# EAGLE design led_shirt (EAGLE 5.11)
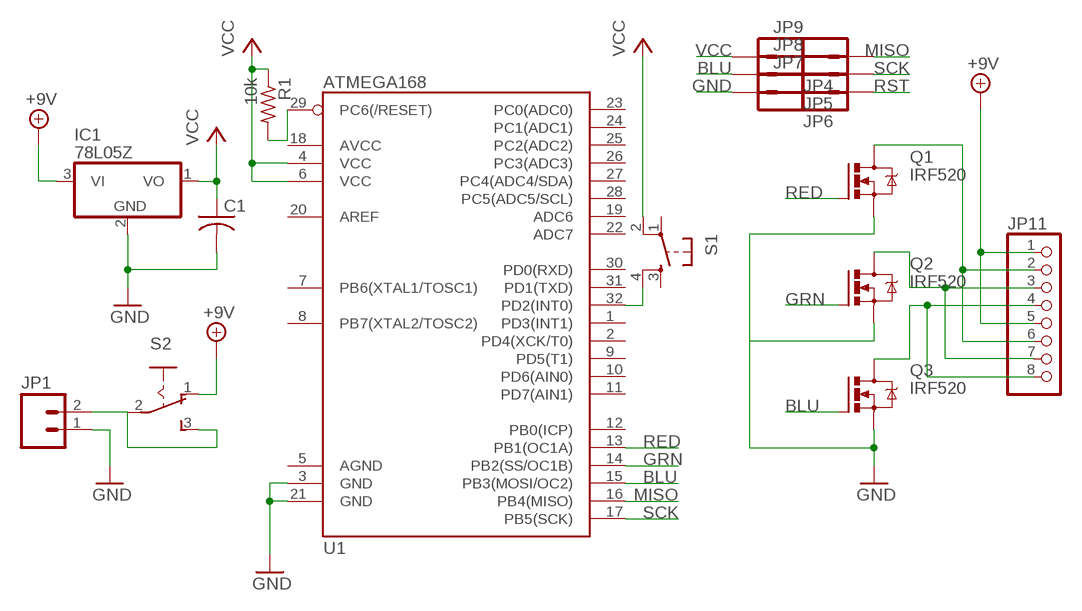
[diagram p0: schematic, sheet 1]

## Parts
C1  C-US025-025X050  [C025-025X050]
IC1  78L05Z  [TO92]
JP1  M02PTH3  [1X02_LONGPADS]
JP4  M01SMD-4.5X1.5  [PAD-1.5X4.5]
JP5  M01SMD-4.5X1.5  [PAD-1.5X4.5]
JP6  M01SMD-4.5X1.5  [PAD-1.5X4.5]
JP7  M01SMD-4.5X1.5  [PAD-1.5X4.5]
JP8  M01SMD-4.5X1.5  [PAD-1.5X4.5]
JP9  M01SMD-4.5X1.5  [PAD-1.5X4.5]
JP11  PINHD-1X8  [1X08]
Q1  IRF520  [TO220BV]
Q2  IRF520  [TO220BV]
Q3  IRF520  [TO220BV]
R1  10k  R-US_R0805  [R0805]
S1  TAC_SWITCHSMD  [TACTILE_SWITCH_SMD]
S2  255SB  [255SB]
U1  ATMEGA168  [TQFP32-08]

## Nets
+9V: IC1.3(VI) JP11.1 JP11.5 S2.1(O)
BLU: JP8.P$1 Q3.G U1.15(PB3(MOSI/OC2))
GND: C1.2 IC1.2(GND) JP1.1 JP7.P$1 Q1.S Q2.S Q3.S U1.3(GND) U1.21(GND)
GRN: Q2.G U1.14(PB2(SS/OC1B))
MISO: JP4.P$1 U1.16(PB4(MISO))
N$1: JP11.2 JP11.6 Q1.D
N$3: JP11.4 JP11.8 Q3.D
N$5: S1.4 U1.32(PD2(INT0))
N$7: JP11.3 JP11.7 Q2.D
N$8: JP1.2 S2.2(P) S2.3(S)
RED: Q1.G U1.13(PB1(OC1A))
RST: JP6.P$1 R1.2 U1.29(PC6(/RESET))
SCK: JP5.P$1 U1.17(PB5(SCK))
VCC: C1.1 IC1.1(VO) JP9.P$1 R1.1 S1.2 U1.4(VCC) U1.6(VCC)
Unconnected: S1.1 S1.3 U1.1(PD3(INT1)) U1.2(PD4(XCK/T0)) U1.5(AGND) U1.7(PB6(XTAL1/TOSC1)) U1.8(PB7(XTAL2/TOSC2)) U1.9(PD5(T1)) U1.10(PD6(AIN0)) U1.11(PD7(AIN1)) U1.12(PB0(ICP)) U1.18(AVCC) U1.19(ADC6) U1.20(AREF) U1.22(ADC7) U1.23(PC0(ADC0)) U1.24(PC1(ADC1)) U1.25(PC2(ADC2)) U1.26(PC3(ADC3)) U1.27(PC4(ADC4/SDA)) U1.28(PC5(ADC5/SCL)) U1.30(PD0(RXD)) U1.31(PD1(TXD))

## Library data of the parts
C1 = rcl:C-US: CAPACITOR, American symbol
IC1 = linear:78*: Positive VOLTAGE REGULATOR Source: http://cache.national.com/ds/LM/LM78L05.pdf http://www.fairchildsemi.com/ds/LM/LM7805.pdf
JP1 = sparkfun:M02: Header 2 Standard 2-pin 0.1" header. Use with straight break away headers (SKU : PRT-00116), right angle break away headers (PRT-00553), swiss pins (PRT-00743), machine pins (PRT-00117), and female headers (PRT-00115). Molex polarized connector foot print use with SKU : PRT-08233 with associated crimp pins and housings.
JP4-JP9 = sparkfun:M01: Header 1 Standard 1-pin 0.1" header. Use with straight break away headers (SKU : PRT-00116), right angle break away headers (PRT-00553), swiss pins (PRT-00743), machine pins (PRT-00117), and female headers (PRT-00115).
JP11 = pinhead:PINHD-1X8: PIN HEADER
Q1-Q3 = transistor-power:IRF520: HEXFET Power MOSFET
R1 = resistor:R-US_: RESISTOR, American symbol
S1 = sparkfun:TAC_SWITCH: Momentary Switch Button commonly used for reset or general input. Spark Fun Electronics SKU : COM-00097
S2 = switch:255SB: SLIDING SWITCH Distributor Buerklin, 11G810
U1 = sparkfun:ATMEGA168

## Board
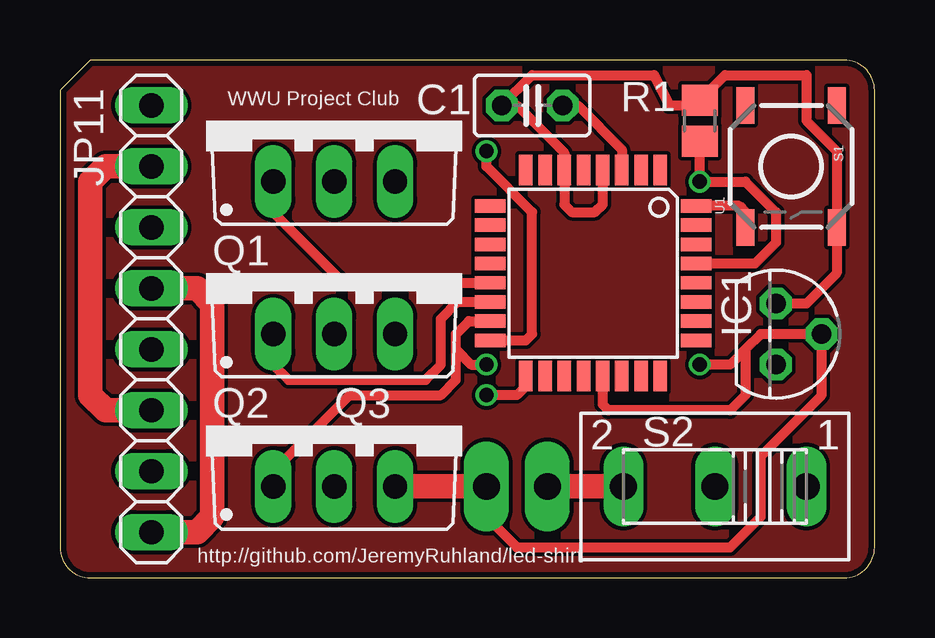
[diagram p1: board, top side]
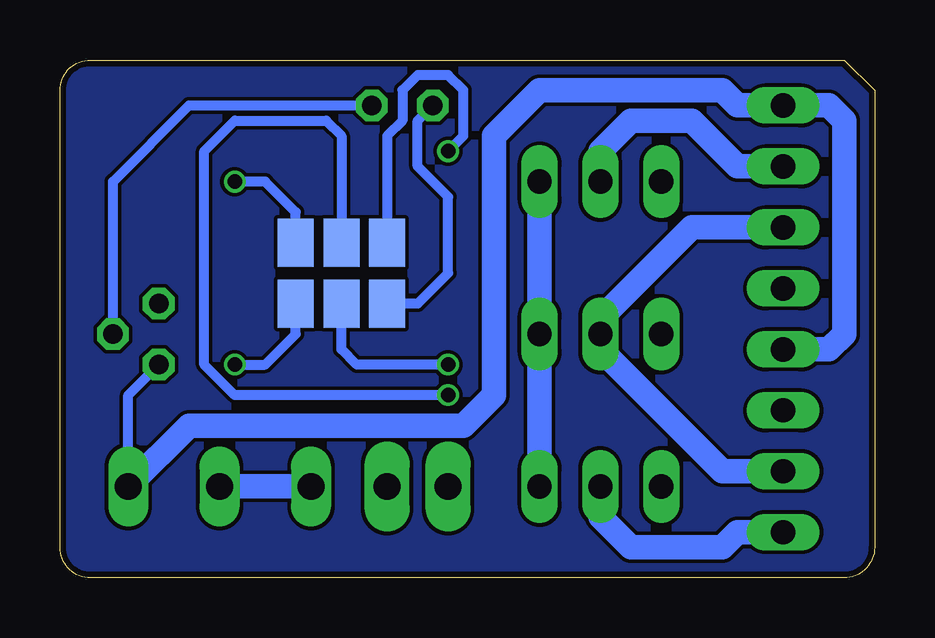
[diagram p2: board, bottom side, seen from below]

Size 33.96 x 21.58 mm. Coordinates in mm from the lower left corner, seen from the top.
Outline: 32.69,0 arc90 33.96,1.27 33.96,20.31 arc90 32.69,21.58 1.27,21.58 0,20.31 0,1.27 arc90 1.27,0 32.69,0
Copper layers (1*16): Top 0.035mm / dielectric 1.5mm / Bottom 0.035mm
Design rules "ITead_rule": minimum track width 6mil, minimum drill 12mil, track to track 6mil, track to pad 6mil, pad to pad 6mil, via to via 6mil, smd to smd 0mil, copper to edge 10mil, drill to drill 10mil, minimum pad ring 10mil, minimum via ring 6mil, stop-mask expansion 2mil, vias tented up to drill 100mil, thermal gap 10mil

### Footprints (pad centres in the part's own frame; a part is rotated, then mirrored left to right if it is on the bottom)
C025-025X050 = drill 0.813 octagon: 1 -1.27,0; 2 1.27,0
TO92 = drill 0.813 octagon: 1 -1.27,0; 2 0,1.905; 3 1.27,0
1X02_LONGPADS = drill 1.118 pad 1.88 long: 1 0,0; 2 2.54,0
PAD-1.5X4.5 = smd 1.5 x 2: P$1 0,0
1X08 = drill 1.016 long: 1 -8.89,0; 2 -6.35,0; 3 -3.81,0; 4 -1.27,0; 5 1.27,0; 6 3.81,0; 7 6.35,0; 8 8.89,0
TO220BV = drill 1.016 long: D 0,-2.54; G -2.54,-2.54; S 2.54,-2.54
R0805 = smd 1.3 x 1.5: 1 -0.85,0; 2 0.85,0
TACTILE_SWITCH_SMD = smd 1.524 x 0.762: 1 -2.54,1.905; 2 2.54,1.905; 3 -2.54,-1.905; 4 2.54,-1.905
255SB = drill 1.118 long: 1 -3.81,0; 2 0,0; 3 3.81,0
TQFP32-08 = smd 1.27 x 0.559: 1 -4.293,2.8; 2 -4.293,2; 3 -4.293,1.2; 4 -4.293,0.4; 5 -4.293,-0.4; 6 -4.293,-1.2; 7 -4.293,-2; 8 -4.293,-2.8; 17 4.293,-2.8; 18 4.293,-2; 19 4.293,-1.2; 20 4.293,-0.4; 21 4.293,0.4; 22 4.293,1.2; 23 4.293,2; 24 4.293,2.8 | smd 0.559 x 1.27: 9 -2.8,-4.293; 10 -2,-4.293; 11 -1.2,-4.293; 12 -0.4,-4.293; 13 0.4,-4.293; 14 1.2,-4.293; 15 2,-4.293; 16 2.8,-4.293; 25 2.8,4.293; 26 2,4.293; 27 1.2,4.293; 28 0.4,4.293; 29 -0.4,4.293; 30 -1.2,4.293; 31 -2,4.293; 32 -2.8,4.293

### Placement (x,y rotation side)
C1  19.68,19.68 0 top
IC1  29.84,10.16 270 top
JP1  17.78,3.81 0 top
JP4  20.32,13.97 180 bottom
JP5  22.23,13.97 180 bottom
JP6  24.13,13.97 180 bottom
JP7  24.13,11.43 180 bottom
JP8  22.23,11.43 180 bottom
JP9  20.32,11.43 180 bottom
JP11  3.81,10.79 270 top
Q1  11.43,19.05 0 top
Q2  11.43,12.7 0 top
Q3  11.43,6.35 0 top
R1  26.67,19.05 270 top
S1  30.48,17.14 270 top
S2  27.3,3.81 180 top
U1  22.23,12.7 270 top

### Tracks (layer width: path | path; a pad name or v marks a point on that pad's centre or on a via)
+9V
  Bottom 0.406: S2.1 31.11,7.62 IC1.3
  Bottom 1.016: JP11.5 1.91,9.53 1.27,10.16 1.27,19.05 1.91,19.68 JP11.1 5.71,19.68 6.35,20.32 13.97,20.32 15.88,18.41 15.88,7.62 17.14,6.35 28.57,6.35 S2.1
BLU  (via drill 0.6)
  Top 0.406: U1.15 17.05,10.7 16.51,10.16 16.51,9.53 | 16.51,9.53 16.51,8.26 15.88,7.62 12.06,7.62 8.89,4.45 Q3.G | v17.78,8.89 17.14,8.89 16.51,9.53
  Bottom 0.406: JP8.P$1 22.23,9.53 21.59,8.89 v17.78,8.89
GND  (via drill 0.6)
  Top 0.406: U1.3 23.43,17.85 21.59,19.68 C1.2 | JP1.1 17.78,2.54 19.05,1.27 27.94,1.27 29.21,2.54 29.21,5.08 31.75,7.62 IC1.2 29.21,10.16 28.57,9.53 | U1.21 22.62,7.22 22.86,6.99 27.94,6.99 28.57,7.62 28.57,9.53 | v26.67,8.89 27.94,8.89 28.57,9.53
  Top 1.016: Q3.S JP1.1
  Bottom 0.406: C1.2 28.57,19.68 31.75,16.51 IC1.2 | v26.67,8.89 25.4,8.89 24.13,10.16 JP7.P$1
  Bottom 1.016: Q1.S Q2.S Q3.S
GRN
  Top 0.406: Q2.G 8.89,8.89 9.53,8.26 15.24,8.26 15.88,8.89 15.88,10.79 16.58,11.5 U1.14
MISO  (via drill 0.6)
  Top 0.406: v17.78,17.78 17.78,17.14 19.68,15.24 19.68,10.16 19.43,9.9 U1.16
  Bottom 0.406: v17.78,17.78 17.14,18.41 17.14,20.32 17.78,20.95 19.05,20.95 19.68,20.32 19.68,19.05 20.32,18.41 JP4.P$1
N$1
  Top 1.016: JP11.6 1.91,6.99 1.27,7.62 1.27,16.51 1.91,17.14 JP11.2
  Bottom 1.016: Q1.D 11.43,17.78 10.16,19.05 7.62,19.05 5.71,17.14 JP11.2
N$2
  pour Top: 33.02,0 arc90 34.29,1.27 34.29,20.32 arc90 33.02,21.59 1.27,21.59 0,20.32 0,1.27 arc90 1.27,0
N$3
  Top 1.016: JP11.4 5.71,12.06 6.35,11.43 6.35,2.54 5.71,1.91 JP11.8
  Bottom 1.016: Q3.D 11.43,2.54 10.16,1.27 6.35,1.27 5.71,1.91 JP11.8
N$4
  pour Bottom: 33.02,21.59 arc-90 34.29,20.32 34.29,1.27 arc-90 33.02,0 1.27,0 arc-90 0,1.27 0,20.32 1.27,21.59
N$5
  Top 0.406: U1.32 28.32,15.5 28.57,15.24 S1.4
N$7
  Bottom 1.016: JP11.7 6.35,4.45 11.43,9.53 Q2.D 11.43,10.79 7.62,14.61 JP11.3
N$8
  Top 1.016: JP1.2 S2.3
  Bottom 1.016: S2.3 S2.2
RED
  Top 0.406: Q1.G 8.89,15.24 11.83,12.3 U1.13
RST  (via drill 0.6)
  Top 0.406: R1.2 v26.67,16.51 28.57,16.51 29.84,15.24 29.84,13.97 28.98,13.1 U1.29
  Bottom 0.406: JP6.P$1 24.13,15.24 25.4,16.51 v26.67,16.51
SCK  (via drill 0.6)
  Top 0.406: U1.17 19.43,8 19.05,7.62 v17.78,7.62
  Bottom 0.406: v17.78,7.62 26.67,7.62 27.94,8.89 27.94,17.78 26.67,19.05 22.86,19.05 22.23,18.41 JP5.P$1
VCC
  Top 0.406: U1.4 22.62,15.56 22.31,15.24 21.34,15.24 21.02,15.56 U1.6 21.02,17.71 19.05,19.68 C1.1 19.68,20.95 24.77,20.95 25.4,19.68 26.45,19.68 R1.1 | IC1.1 31.11,11.43 32.38,12.7 S1.2 32.38,17.78 31.11,19.05 31.11,20.95 27.73,20.95 R1.1 | R1.1 26.67,20.32
  Bottom 0.406: JP9.P$1 19.05,11.43 17.78,12.7 17.78,15.88 19.05,17.14 19.05,19.05 C1.1

### Text on the board
tNames: WWU Project Club | http://github.com/JeremyRuhland/led-shirt